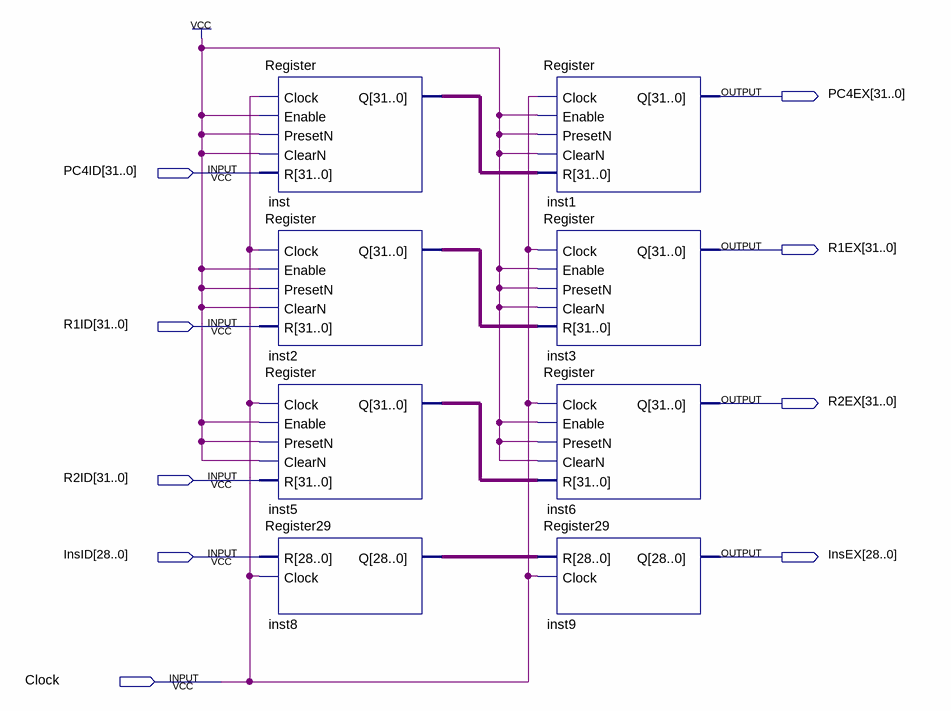
[diagram p0: schematic sheet]
// Quartus schematic B_ID_EX.bdf as structural Verilog: 8 symbols, 9 pins
module B_ID_EX (
  input  [31:0] PC4ID,
  input  [31:0] R1ID,
  input  [31:0] R2ID,
  input  [28:0] InsID,
  input  Clock,
  output [31:0] PC4EX,
  output [31:0] R1EX,
  output [31:0] R2EX,
  output [28:0] InsEX
);

  wire [28:0] inst8_q;
  wire [31:0] inst2_q, inst5_q, inst_q;

  Register inst (.Clock(Clock), .Enable(1'b1), .PresetN(1'b1), .ClearN(1'b1), .R(PC4ID), .Q(inst_q));
  Register inst2 (.Clock(Clock), .Enable(1'b1), .PresetN(1'b1), .ClearN(1'b1), .R(R1ID), .Q(inst2_q));
  Register inst5 (.Clock(Clock), .Enable(1'b1), .PresetN(1'b1), .ClearN(1'b1), .R(R2ID), .Q(inst5_q));
  Register29 inst8 (.R(InsID), .Clock(Clock), .Q(inst8_q));
  Register inst1 (.Clock(Clock), .Enable(1'b1), .PresetN(1'b1), .ClearN(1'b1), .R(inst_q), .Q(PC4EX));
  Register inst3 (.Clock(Clock), .Enable(1'b1), .PresetN(1'b1), .ClearN(1'b1), .R(inst2_q), .Q(R1EX));
  Register inst6 (.Clock(Clock), .Enable(1'b1), .PresetN(1'b1), .ClearN(1'b1), .R(inst5_q), .Q(R2EX));
  Register29 inst9 (.R(inst8_q), .Clock(Clock), .Q(InsEX));
endmodule
